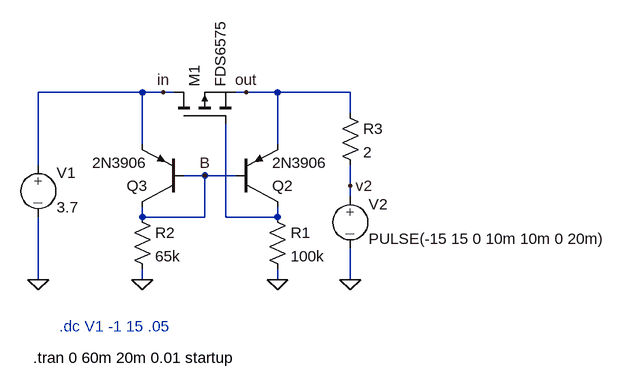
[diagram p0: schematic ideal_diode_discrete.asc]
ideal_diode_discrete.asc, the LTspice schematic file:
Version 4
SHEET 1 980 680
WIRE 272 64 112 64
WIRE 304 64 272 64
WIRE 320 64 304 64
WIRE 432 64 416 64
WIRE 480 64 432 64
WIRE 592 64 480 64
WIRE 592 96 592 64
WIRE 272 144 272 64
WIRE 480 144 480 64
WIRE 112 176 112 64
WIRE 368 192 336 192
WIRE 416 192 368 192
WIRE 592 208 592 176
WIRE 592 224 592 208
WIRE 272 256 272 240
WIRE 368 256 368 192
WIRE 368 256 272 256
WIRE 400 256 400 112
WIRE 480 256 480 240
WIRE 480 256 400 256
WIRE 112 352 112 256
WIRE 272 352 272 336
WIRE 480 352 480 336
WIRE 592 352 592 304
FLAG 272 352 0
FLAG 480 352 0
FLAG 304 64 in
FLAG 432 64 out
FLAG 112 352 0
FLAG 592 352 0
FLAG 592 208 v2
FLAG 368 192 B
SYMBOL EIT_Semi\\pnp 416 240 M180
SYMATTR InstName Q2
SYMATTR Value 2N3906
SYMBOL EIT_Semi\\pnp 336 240 R180
SYMATTR InstName Q3
SYMATTR Value 2N3906
SYMBOL EIT_Semi\\pmos 320 112 R270
SYMATTR InstName M1
SYMATTR Value FDS6575
SYMBOL res 464 240 R0
SYMATTR InstName R1
SYMATTR Value 100k
SYMBOL res 256 240 R0
SYMATTR InstName R2
SYMATTR Value 65k
SYMBOL res 576 80 R0
SYMATTR InstName R3
SYMATTR Value 2
SYMBOL MDB_sym\\source-V 112 160 R0
WINDOW 123 0 0 Left 0
WINDOW 39 0 0 Left 0
SYMATTR InstName V1
SYMATTR Value 3.7
SYMBOL MDB_sym\\source-V 592 208 R0
WINDOW 123 0 0 Left 0
WINDOW 39 0 0 Left 0
SYMATTR InstName V2
SYMATTR Value PULSE(-15 15 0 10m 10m 0 20m)
TEXT 144 424 Left 2 ;.dc V1 -1 15 .05
TEXT 104 472 Left 2 !.tran 0 60m 20m 0.01 startup

The netlist it stands for:
* ideal_diode_discrete.asc
Q2 N001 B out 0 2N3906
Q3 B B in 0 2N3906
M1 in N001 out out FDS6575
R1 N001 0 100k
R2 B 0 65k
R3 out v2 2
V1 in 0 3.7
V2 v2 0 PULSE(-15 15 0 10m 10m 0 20m)
.model NPN NPN
.model PNP PNP
.lib standard.bjt
.model NMOS NMOS
.model PMOS PMOS
.lib standard.mos
* .dc V1 -1 15 .05
.tran 0 60m 20m 0.01 startup
.backanno
.end